# EAGLE design mp3triggerv3 (EAGLE 6.2)
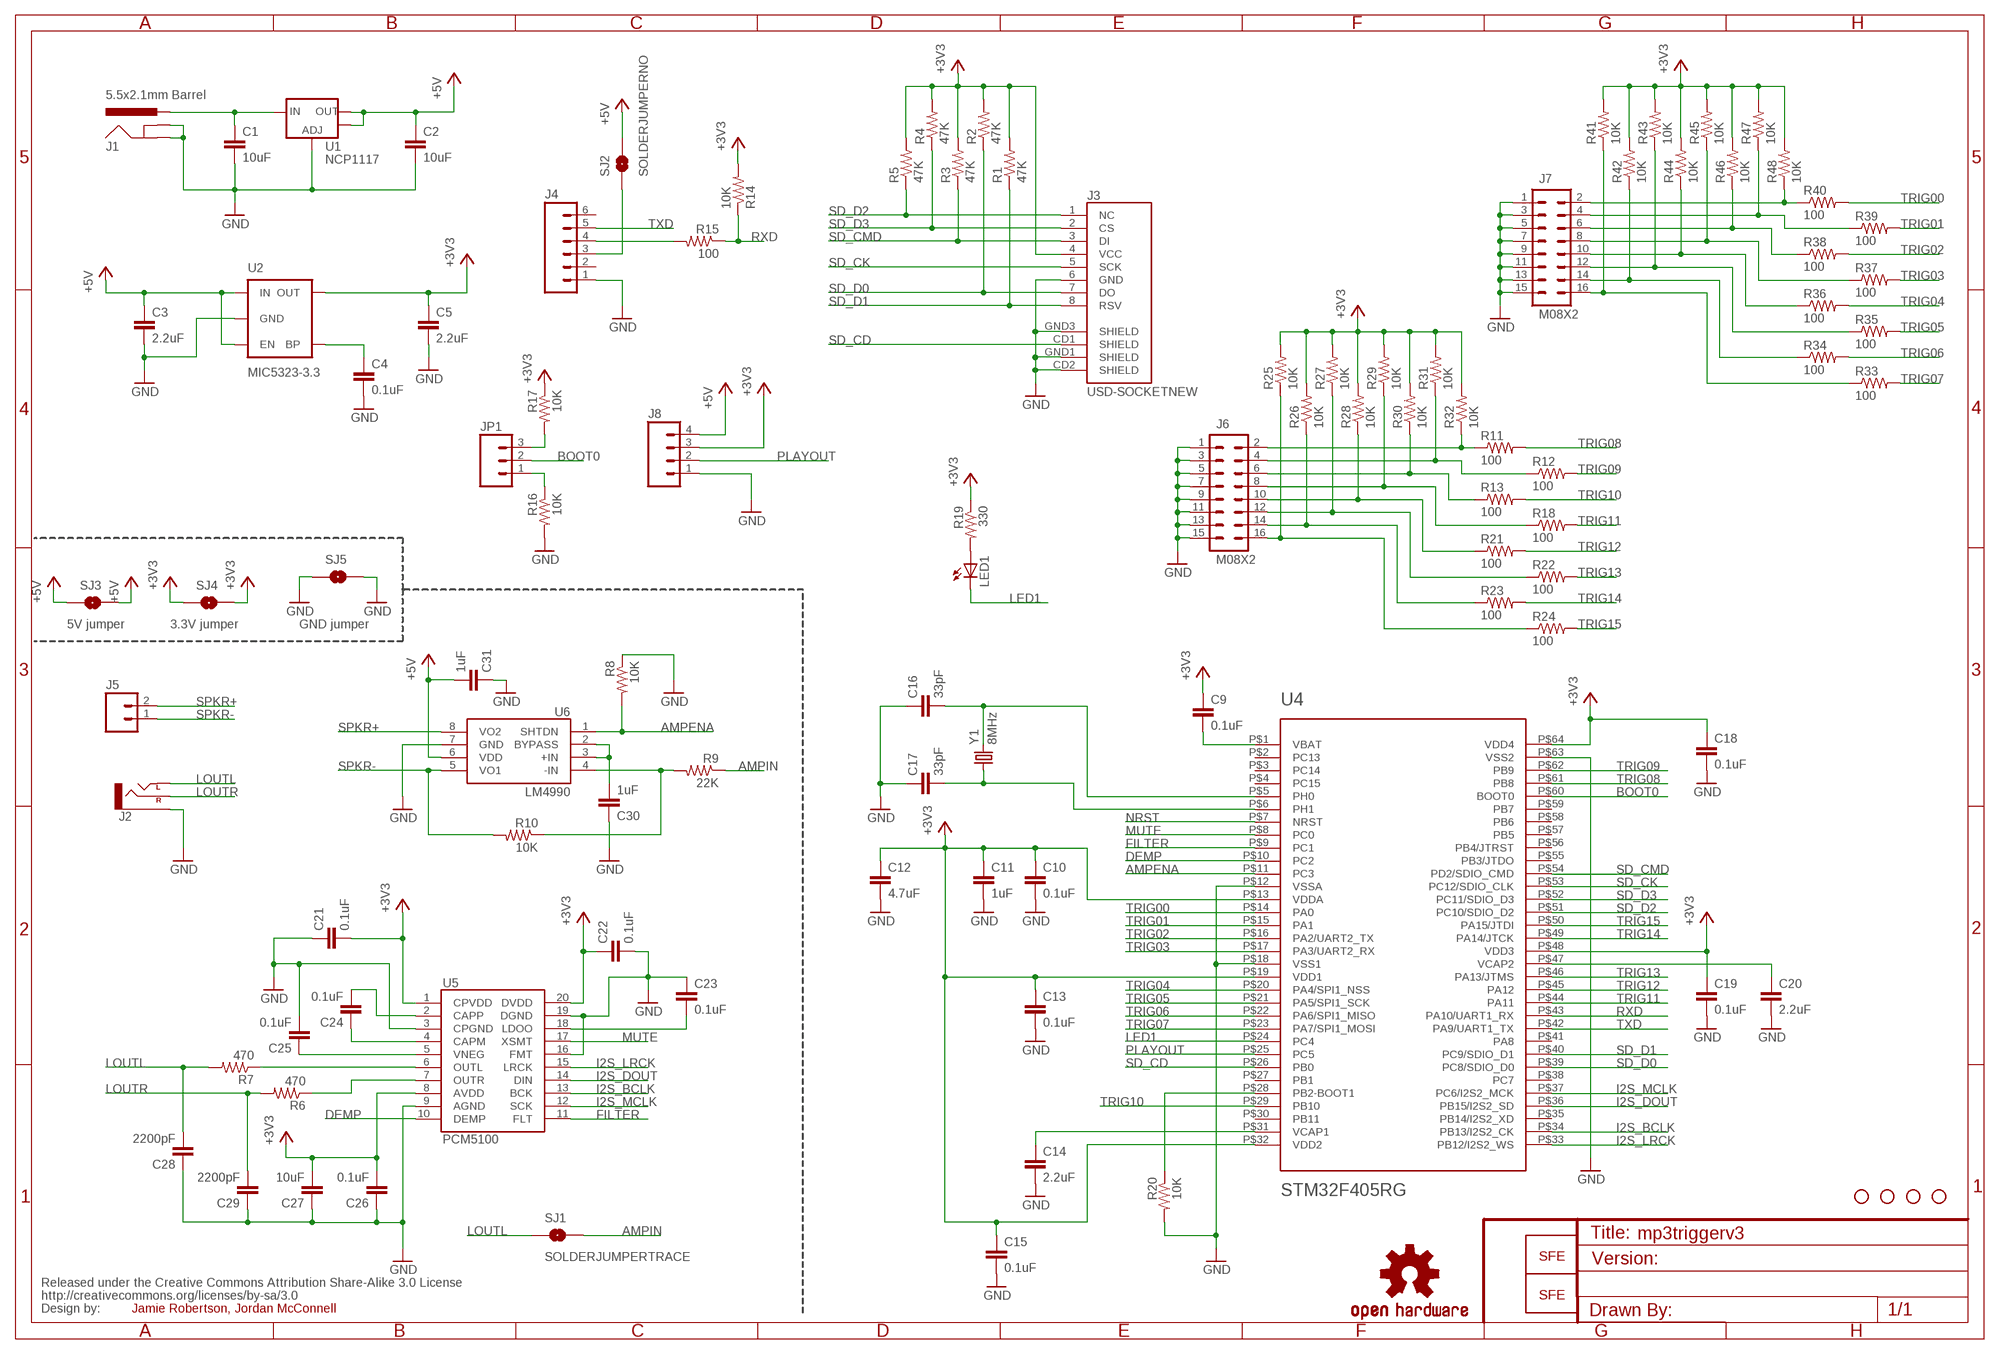
[diagram p0: schematic, sheet 1]

## Parts
C1  10uF  10UF50V20%(1210)  [1210]
C2  10uF  1UF-25V-10%(0805)  [0805]
C3  2.2uF  1UF-25V-10%(0805)  [0805]
C4  0.1uF  CAP0603-CAP  [0603-CAP]
C5  2.2uF  1UF-25V-10%(0805)  [0805]
C9  0.1uF  CAP0603-CAP  [0603-CAP]
C10  0.1uF  CAP0603-CAP  [0603-CAP]
C11  1uF  CAP0603-CAP  [0603-CAP]
C12  4.7uF  CAP0603-CAP  [0603-CAP]
C13  0.1uF  CAP0603-CAP  [0603-CAP]
C14  2.2uF  CAP0603-CAP  [0603-CAP]
C15  0.1uF  CAP0603-CAP  [0603-CAP]
C16  33pF  CAP0603-CAP  [0603-CAP]
C17  33pF  CAP0603-CAP  [0603-CAP]
C18  0.1uF  CAP0603-CAP  [0603-CAP]
C19  0.1uF  CAP0603-CAP  [0603-CAP]
C20  2.2uF  CAP0603-CAP  [0603-CAP]
C21  0.1uF  CAP0603-CAP  [0603-CAP]
C22  0.1uF  CAP0603-CAP  [0603-CAP]
C23  0.1uF  CAP0603-CAP  [0603-CAP]
C24  0.1uF  CAP0603-CAP  [0603-CAP]
C25  0.1uF  CAP0603-CAP  [0603-CAP]
C26  0.1uF  CAP0603-CAP  [0603-CAP]
C27  10uF  CAP0603-CAP  [0603-CAP]
C28  2200pF  CAP0603-CAP  [0603-CAP]
C29  2200pF  CAP0603-CAP  [0603-CAP]
C30  1uF  CAP0603-CAP  [0603-CAP]
C31  1uF  CAP0603-CAP  [0603-CAP]
CC_TEXT1  CREATIVE_COMMONS  [CREATIVE_COMMONS]
J1  5.5x2.1mm Barrel  POWER_JACKSMD  [POWER_JACK_SMD]
J2  AUDIO-JACKSMD2  [AUDIO-JACK-3.5MM-SMD]
J3  USD-SOCKETNEW  [MICRO-SD-SOCKET-PP]
J4  M06SIP  [1X06]
J5  M02PTH  [1X02]
J6  M08X2  [2X8]
J7  M08X2  [2X8]
J8  M04PTH  [1X04]
JP1  M03PTH  [1X03]
LED1  LED0603  [LED-0603]
LOGO1  OSHW-LOGOL  [OSHW-LOGO-L]
LOGO2  LOGO-SFENEW  [SFE-NEW-WEBLOGO]
LOGO3  LOGO-SFESK  [SFE-LOGO-FLAME]
R1  47K  RESISTOR0603-RES  [0603-RES]
R2  47K  RESISTOR0603-RES  [0603-RES]
R3  47K  RESISTOR0603-RES  [0603-RES]
R4  47K  RESISTOR0603-RES  [0603-RES]
R5  47K  RESISTOR0603-RES  [0603-RES]
R6  470  RESISTOR0603-RES  [0603-RES]
R7  470  RESISTOR0603-RES  [0603-RES]
R8  10K  RESISTOR0603-RES  [0603-RES]
R9  22K  RESISTOR0603-RES  [0603-RES]
R10  10K  RESISTOR0603-RES  [0603-RES]
R11  100  RESISTOR0603-RES  [0603-RES]
R12  100  RESISTOR0603-RES  [0603-RES]
R13  100  RESISTOR0603-RES  [0603-RES]
R14  10K  RESISTOR0603-RES  [0603-RES]
R15  100  RESISTOR0603-RES  [0603-RES]
R16  10K  RESISTOR0603-RES  [0603-RES]
R17  10K  RESISTOR0603-RES  [0603-RES]
R18  100  RESISTOR0603-RES  [0603-RES]
R19  330  RESISTOR0603-RES  [0603-RES]
R20  10K  RESISTOR0603-RES  [0603-RES]
R21  100  RESISTOR0603-RES  [0603-RES]
R22  100  RESISTOR0603-RES  [0603-RES]
R23  100  RESISTOR0603-RES  [0603-RES]
R24  100  RESISTOR0603-RES  [0603-RES]
R25  10K  RESISTOR0603-RES  [0603-RES]
R26  10K  RESISTOR0603-RES  [0603-RES]
R27  10K  RESISTOR0603-RES  [0603-RES]
R28  10K  RESISTOR0603-RES  [0603-RES]
R29  10K  RESISTOR0603-RES  [0603-RES]
R30  10K  RESISTOR0603-RES  [0603-RES]
R31  10K  RESISTOR0603-RES  [0603-RES]
R32  10K  RESISTOR0603-RES  [0603-RES]
R33  100  RESISTOR0603-RES  [0603-RES]
R34  100  RESISTOR0603-RES  [0603-RES]
R35  100  RESISTOR0603-RES  [0603-RES]
R36  100  RESISTOR0603-RES  [0603-RES]
R37  100  RESISTOR0603-RES  [0603-RES]
R38  100  RESISTOR0603-RES  [0603-RES]
R39  100  RESISTOR0603-RES  [0603-RES]
R40  100  RESISTOR0603-RES  [0603-RES]
R41  10K  RESISTOR0603-RES  [0603-RES]
R42  10K  RESISTOR0603-RES  [0603-RES]
R43  10K  RESISTOR0603-RES  [0603-RES]
R44  10K  RESISTOR0603-RES  [0603-RES]
R45  10K  RESISTOR0603-RES  [0603-RES]
R46  10K  RESISTOR0603-RES  [0603-RES]
R47  10K  RESISTOR0603-RES  [0603-RES]
R48  10K  RESISTOR0603-RES  [0603-RES]
SJ1  SOLDERJUMPERTRACE  [SJ_2S-TRACE]
SJ2  SOLDERJUMPERNO  [SJ_2S-NO]
SJ3  SOLDERJUMPERTRACE  [SJ_2S-TRACE]
SJ4  SOLDERJUMPERTRACE  [SJ_2S-TRACE]
SJ5  SOLDERJUMPERTRACE  [SJ_2S-TRACE]
STANDOFF1  STAND-OFF  [STAND-OFF]
STANDOFF2  STAND-OFF  [STAND-OFF]
STANDOFF3  STAND-OFF  [STAND-OFF]
STANDOFF4  STAND-OFF  [STAND-OFF]
U1  NCP1117  V_REG_LM1117SOT223  [SOT223]
U2  MIC5323-3.3  MIC52053.3V  [SOT23-5]
U4  STM32F405RG  [TQFP-10X10-64]
U5  PCM5100  [PW_R-PDSO-G20]
U6  LM4990  [S-PDSO-G08]
Y1  8MHz  CRYSTALSMD  [HC49UP]

## Nets
+5V: C2.1 C3.1 C31.2 J8.4 SJ2.2 SJ3.1 SJ3.2 U1.2(OUT) U1.4(OUT) U2.1(IN) U2.3(EN) U6.6(VDD)
AMPENA: R8.2 U4.P$11(PC3) U6.1(SHTDN)
AMPIN: R9.1 SJ1.2
BOOT0: JP1.2 U4.P$60(BOOT0)
DEMP: U4.P$10(PC2) U5.10(DEMP)
FILTER: U4.P$9(PC1) U5.11(FLT)
GND: C1.2 C2.2 C3.2 C4.2 C5.2 C10.2 C11.2 C12.2 C13.2 C14.2 C15.2 C16.1 C17.1 C18.2 C19.2 C20.2 C21.1 C22.2 C23.1 C25.2 C26.1 C27.1 C28.1 C29.1 C30.1 C31.1 J1.GND(GNDBREAK) J1.P$4(GND) J2.SLEEVE J3.6(GND) J3.CD2(SHIELD) J3.GND1(SHIELD) J3.GND3(SHIELD) J4.1 J6.1 J6.3 J6.5 J6.7 J6.9 J6.11 J6.13 J6.15 J7.1 J7.3 J7.5 J7.7 J7.9 J7.11 J7.13 J7.15 J8.1 R8.1 R16.2 R20.2 SJ5.1 SJ5.2 U1.1(ADJ) U2.2(GND) U4.P$12(VSSA) U4.P$18(VSS1) U4.P$63(VSS2) U5.3(CPGND) U5.9(AGND) U5.16(FMT) U5.19(DGND) U6.7(GND)
I2S_BCLK: U4.P$34(PB13/I2S2_CK) U5.13(BCK)
I2S_DOUT: U4.P$36(PB15/I2S2_SD) U5.14(DIN)
I2S_LRCK: U4.P$33(PB12/I2S2_WS) U5.15(LRCK)
I2S_MCLK: U4.P$37(PC6/I2S2_MCK) U5.12(SCK)
LED1: LED1.C U4.P$24(PC4)
LOUTL: C28.2 J2.TIP(LEFT) R7.2 SJ1.1
LOUTR: C29.2 J2.RING(RIGHT) R6.2
MUTE: U4.P$8(PC0) U5.17(XSMT)
N$1: J6.2 R11.1 R32.1
N$2: C4.1 U2.4(BP)
N$3: C9.2 U4.P$1(VBAT)
N$4: C14.1 U4.P$31(VCAP1)
N$5: C16.2 U4.P$5(PH0) Y1.2
N$6: C17.2 U4.P$6(PH1) Y1.1
N$7: JP1.1 R16.1
N$8: C20.1 U4.P$47(VCAP2)
N$9: J4.4 R15.2
N$10: JP1.3 R17.2
N$11: LED1.A R19.2
N$12: R20.1 U4.P$28(PB2-BOOT1)
N$14: C23.2 U5.18(LDOO)
N$15: R6.1 U5.7(OUTR)
N$16: C24.2 U5.2(CAPP)
N$17: C24.1 U5.4(CAPM)
N$18: C25.1 U5.5(VNEG)
N$19: R7.1 U5.6(OUTL)
N$20: C30.2 U6.2(BYPASS) U6.3(+IN)
N$23: J6.4 R12.1 R31.1
N$24: J6.6 R13.1 R30.1
N$25: J6.8 R18.1 R29.1
N$26: J6.10 R21.1 R28.1
N$27: J6.12 R22.1 R27.1
N$28: J6.14 R23.1 R26.1
N$29: R9.2 R10.1 U6.4(-IN)
N$30: J6.16 R24.1 R25.1
N$32: J4.3 SJ2.1
N$35: J7.2 R40.1 R48.1
N$36: J7.4 R39.1 R47.1
N$37: J7.6 R38.1 R46.1
N$38: J7.8 R37.1 R45.1
N$39: J7.10 R36.1 R44.1
N$40: J7.12 R35.1 R43.1
N$41: J7.14 R34.1 R42.1
N$42: J7.16 R33.1 R41.1
NRST: U4.P$7(NRST)
PLAYOUT: J8.2 U4.P$25(PC5)
RXD: R14.1 R15.1 U4.P$43(PA10/UART1_RX)
SD_CD: J3.CD1(SHIELD) U4.P$26(PB0)
SD_CK: J3.5(SCK) U4.P$53(PC12/SDIO_CLK)
SD_CMD: J3.3(DI) R3.1 U4.P$54(PD2/SDIO_CMD)
SD_D0: J3.7(DO) R2.1 U4.P$39(PC8/SDIO_D0)
SD_D1: J3.8(RSV) R1.1 U4.P$40(PC9/SDIO_D1)
SD_D2: J3.1(NC) R5.1 U4.P$51(PC10/SDIO_D2)
SD_D3: J3.2(CS) R4.1 U4.P$52(PC11/SDIO_D3)
SPKR+: J5.2 U6.8(VO2)
SPKR-: J5.1 R10.2 U6.5(VO1)
TRIG00: R40.2 U4.P$14(PA0)
TRIG01: R39.2 U4.P$15(PA1)
TRIG02: R38.2 U4.P$16(PA2/UART2_TX)
TRIG03: R37.2 U4.P$17(PA3/UART2_RX)
TRIG04: R36.2 U4.P$20(PA4/SPI1_NSS)
TRIG05: R35.2 U4.P$21(PA5/SPI1_SCK)
TRIG06: R34.2 U4.P$22(PA6/SPI1_MISO)
TRIG07: R33.2 U4.P$23(PA7/SPI1_MOSI)
TRIG08: R11.2 U4.P$61(PB8)
TRIG09: R12.2 U4.P$62(PB9)
TRIG10: R13.2 U4.P$29(PB10)
TRIG11: R18.2 U4.P$44(PA11)
TRIG12: R21.2 U4.P$45(PA12)
TRIG13: R22.2 U4.P$46(PA13/JTMS)
TRIG14: R23.2 U4.P$49(PA14/JTCK)
TRIG15: R24.2 U4.P$50(PA15/JTDI)
TXD: J4.5 U4.P$42(PA9/UART1_TX)
VCC: C5.1 C9.1 C10.1 C11.1 C12.1 C13.1 C15.1 C18.1 C19.1 C21.2 C22.1 C26.2 C27.2 J3.4(VCC) J8.3 R1.2 R2.2 R3.2 R4.2 R5.2 R14.2 R17.1 R19.1 R25.2 R26.2 R27.2 R28.2 R29.2 R30.2 R31.2 R32.2 R41.2 R42.2 R43.2 R44.2 R45.2 R46.2 R47.2 R48.2 SJ4.1 SJ4.2 U2.5(OUT) U4.P$13(VDDA) U4.P$19(VDD1) U4.P$32(VDD2) U4.P$48(VDD3) U4.P$64(VDD4) U5.1(CPVDD) U5.8(AVDD) U5.20(DVDD) ; supply symbol labelled +3V3
VIN_9V: C1.1 J1.VIN0(PWR) U1.3(IN)
Unconnected: J4.2 J4.6 U4.P$2(PC13) U4.P$3(PC14) U4.P$4(PC15) U4.P$27(PB1) U4.P$30(PB11) U4.P$35(PB14/I2S2_XD) U4.P$38(PC7) U4.P$41(PA8) U4.P$55(PB3/JTDO) U4.P$56(PB4/JTRST) U4.P$57(PB5) U4.P$58(PB6) U4.P$59(PB7)

## Notes on the sheet
- 5V jumper | 3.3V jumper | GND jumper
- Jamie Robertson, Jordan McConnell

## Library data of the parts
C1 = SparkFun-Capacitors:10UF50V20%(1210): CAP-09824; PROD_ID: CAP-09824
C2 C3 C5 = SparkFun-Capacitors:1UF-25V-10%(0805): CAP-08064; PROD_ID: CAP-08064; VALUE: 1uF
C4 C9-C31 = SparkFun-Capacitors:CAP: Capacitor Standard 0603 ceramic capacitor, and 0.1" leaded capacitor.
CC_TEXT1 = SparkFun-Aesthetics:CREATIVE_COMMONS: Creative Commons License summary
J1 = SparkFun-Connectors:POWER_JACK: Power Jack This is the standard 5.5mm barrel jack for power. The PTH is the most common, proven, reliable, footprint. The Slot footprint only works if the mill layer is transmitted to the PCB fab house so be warned. Spark Fun Electronics SKU : PRT-00119 SMT: CONN-08106 Mating wall wart : TOL-00298 (and others); PROD_ID: CONN-08106
J2 = SparkFun-Connectors:AUDIO-JACK: 3.5mm Audio Jack Simple 3.5mm common PCB mount audio jack. SKU: PRT-08032
J3 = robertsonics:USD-SOCKET: microSD Socket Push-push type uSD socket. Schematic element and footprint production proven. Spark Fun Electronics SKU : PRT-00127. tDoc lines correctly indicate media card edge positions when inserting (unlocked, locked, depressed).
J4 = SparkFun-Connectors:M06: Header 6 Standard 6-pin 0.1" header. Use with straight break away headers (SKU : PRT-00116), right angle break away headers (PRT-00553), swiss pins (PRT-00743), machine pins (PRT-00117), and female headers (PRT-00115). Molex polarized connector foot print use with SKU : PRT-08094 with associated crimp pins and housings. NOTES ON THE VARIANTS LOCK and LOCK_LONGPADS... This footprint was designed to help hold the alignment of a through-hole component (i.e. 6-pin header) while soldering it into place. You may notice that each hole has been shifted either up or down by 0.005 of an inch from it's more standard position (which is a perfectly straight line). This slight alteration caused the pins (the squares in the middle) to touch the edges of the holes. Because they are alternating, it causes a "brace" to hold the component in place. 0.005 has proven to be the perfect amount of "off-center" position when using our standard breakaway headers. Although looks a little odd when you look at the bare footprint, once you have a header in there, the alteration is very hard to notice. Also, if you push a header all the way into place, it is covered up entirely on the bottom side. This idea of altering the position of holes to aid alignment will be further integrated into the Sparkfun Library for other footprints. It can help hold any component with 3 or more connection pins.
J5 = SparkFun-Connectors:M02: Header 2 Standard 2-pin 0.1" header. Use with straight break away headers (SKU : PRT-00116), right angle break away headers (PRT-00553), swiss pins (PRT-00743), machine pins (PRT-00117), and female headers (PRT-00115). Molex polarized connector foot print use with SKU : PRT-08233 with associated crimp pins and housings.
J6 J7 = SparkFun-Connectors:M08X2: .1" headers, two rows of 8 each
J8 = SparkFun-Connectors:M04: Header 4 Standard 4-pin 0.1" header. Use with straight break away headers (SKU : PRT-00116), right angle break away headers (PRT-00553), swiss pins (PRT-00743), machine pins (PRT-00117), and female headers (PRT-00115). Molex polarized connector foot print use with SKU : PRT-08231 with associated crimp pins and housings. 1MM SMD Version SKU: PRT-10208
JP1 = SparkFun-Connectors:M03: Header 3 Standard 3-pin 0.1" header. Use with straight break away headers (SKU : PRT-00116), right angle break away headers (PRT-00553), swiss pins (PRT-00743), machine pins (PRT-00117), and female headers (PRT-00115). Molex polarized connector foot print use with SKU : PRT-08232 with associated crimp pins and housings.
LED1 = SparkFun-LED:LED: LEDs Standard schematic elements and footprints for 5mm, 3mm, 1206, and 0603 sized LEDs. 5mm - Spark Fun Electronics SKU : COM-00529 (and others)
LOGO1 = SparkFun-Aesthetics:OSHW-LOGO: Open Source Hardware Logo This logo indicates the piece of hardware it is found on incorporates a OSHW license and/or adheres to the definition of open source hardware found here: http://freedomdefined.org/OSHW
LOGO2 LOGO3 = SparkFun-Aesthetics:LOGO-SFE: Spark Fun Electronics PCB Logo This is the standard Spark Fun Electronics PCB logo.
R1-R48 = SparkFun-Passives:RESISTOR: Resistor Basic schematic elements and footprints for 0603, 1206, and PTH resistors.
SJ1-SJ5 = SparkFun-Passives:SOLDERJUMPER: Solder Jumper Standard SMD solder jumper. Used to automate production. Two varients : Normally Open and Normally Closed are the same, but have different paste layers. NC will have a large amount of paste and should jumper during reflow.
STANDOFF1-STANDOFF4 = SparkFun-Electromechanical:STAND-OFF: #4 Stand Off This is the mechanical footprint for a #4 phillips button head screw. Use the keepout ring to avoid running the screw head into surrounding components. SKU : PRT-00447
U1 = SparkFun-PowerIC:V_REG_LM1117: Voltage Regulator LM1117 Standard adjustable voltage regulator but in SMD form. Spark Fun Electronics SKU : COM-00595
U2 = SparkFun-PowerIC:MIC5205: MIC5205 150mA vreg 3.3V - VREG-00822 5V - VREG-00823; PROD_ID: VREG-00822
U4 = robertsonics:STM32F405RG: STM32F405RG LQFP64
U5 = robertsonics:PCM5100: PCM5100 Stereo DAC
U6 = robertsonics:LM4990: LM4990 2 Watt Audio Amp
Y1 = SparkFun-FreqCtrl:CRYSTAL: Various standard crystals. Proven footprints. Spark Fun Electronics SKU : COM-00534

## Board
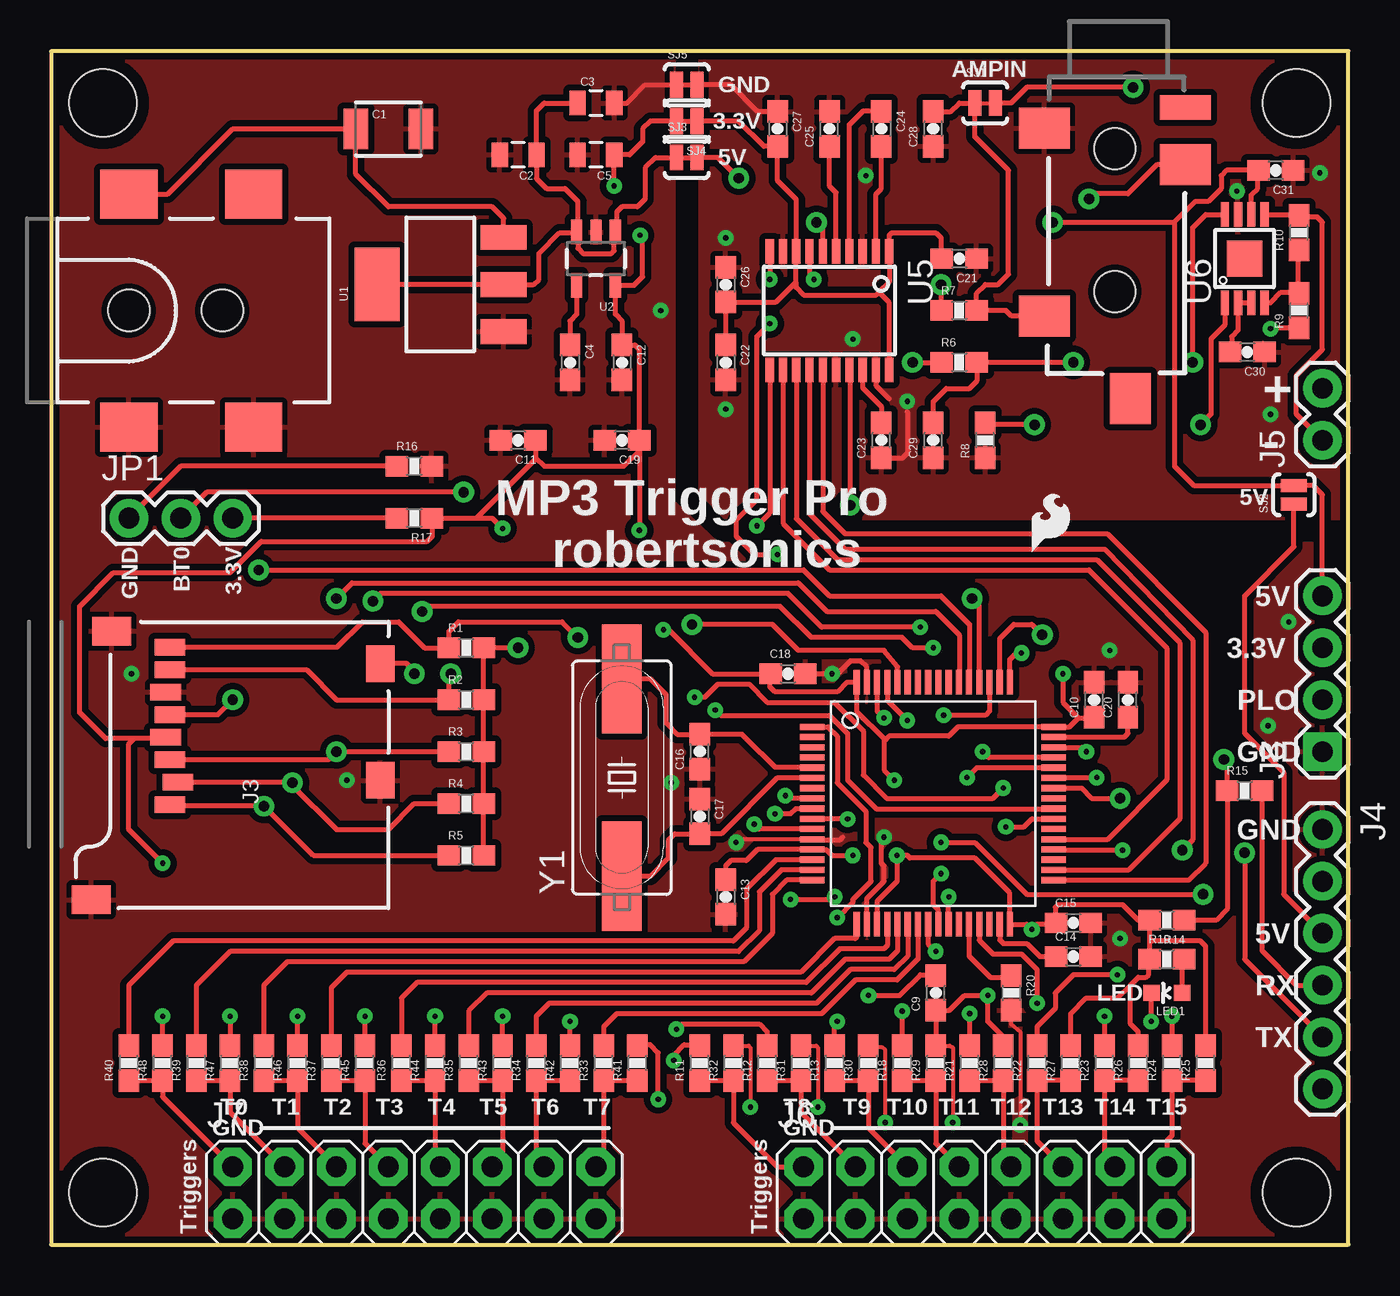
[diagram p1: board, top side]
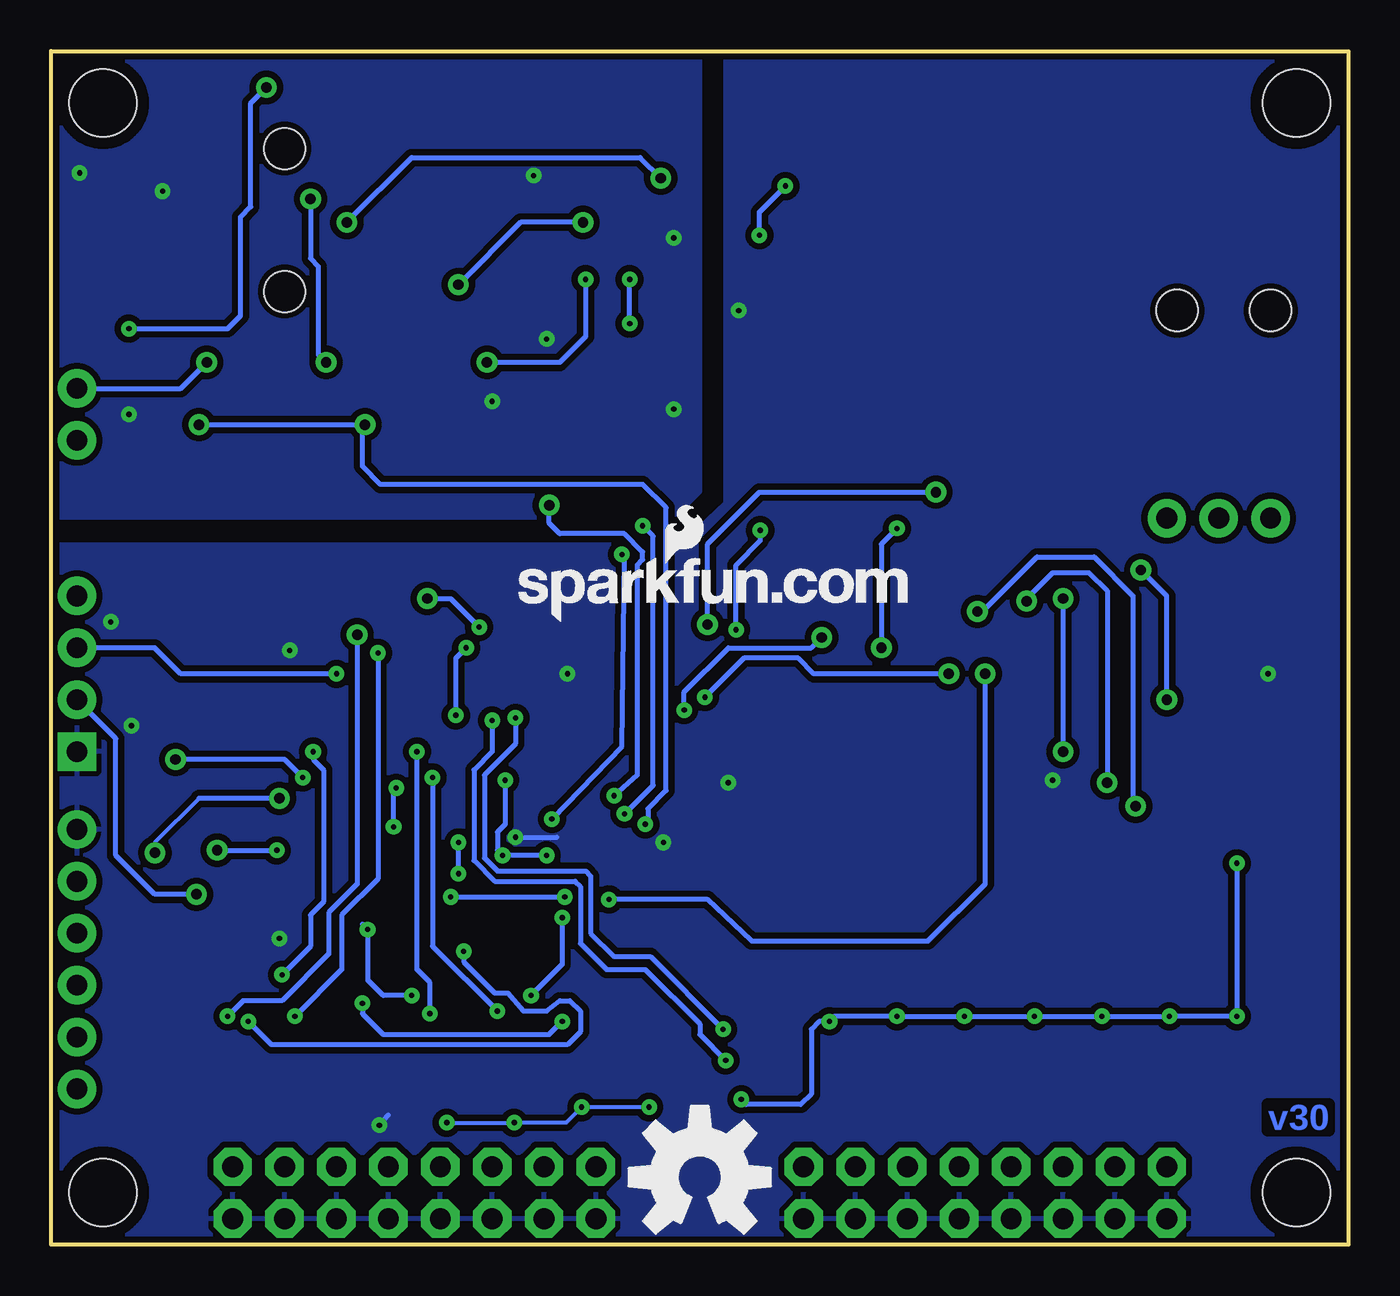
[diagram p2: board, bottom side, seen from below]

Size 63.5 x 58.42 mm. Coordinates in mm from the lower left corner, seen from the top.
Outline: 0,0 63.5,0 63.5,58.42 0,58.41 0,0
Copper layers (1*16): Top 0.035mm / dielectric 1.5mm / Bottom 0.035mm
Design rules "default": minimum track width 8mil, minimum drill 10mil, track to track 6mil, track to pad 6mil, pad to pad 6mil, via to via 6mil, smd to smd 6mil, copper to edge 8mil, drill to drill 8mil, minimum pad ring 12mil, minimum via ring 10mil, stop-mask expansion 4mil, vias tented up to drill 20mil, thermal gap 10mil

### Footprints (pad centres in the part's own frame; a part is rotated, then mirrored left to right if it is on the bottom)
1210 = smd 1.2 x 2: 1 -1.6,0; 2 1.6,0
0805 = smd 0.8 x 1.2: 1 -0.9,0; 2 0.9,0
0603-CAP = smd 1.1 x 1: 1 -0.85,0; 2 0.85,0
POWER_JACK_SMD = smd 2.8 x 2.4: GND 0,-5.7; P$4 6.1,-5.7; VIN0 0,5.7; VIN1 6.1,5.7 | hole 2.032: 0,0; 4.572,0
AUDIO-JACK-3.5MM-SMD = smd 2 x 2.5: RING 4.3,3.45; SLEEVE 2.5,-3.45; TIP 11.7,-3.45 | smd 1.2 x 2.5: RSH 1.5,3.45 | smd 2.5 x 2: TSH 15.75,0.75 | hole 2: 3.5,0; 10.5,0
MICRO-SD-SOCKET-PP = smd 0.8 x 1.5: 1 -8.94,10.7; 2 -7.84,10.3; 3 -6.74,10.7; 4 -5.64,10.9; 5 -4.54,10.7; 6 -3.44,10.9; 7 -2.34,10.7; 8 -1.24,10.7 | smd 1.8 x 1.4: CD1 -2.05,0.4; CD2 -7.75,0.4 | smd 1.4 x 1.9: GND1 -13.6,14.55; GND3 -0.45,13.55
1X06 = drill 1.016 pad 1.88: 1 0,0; 2 2.54,0; 3 5.08,0; 4 7.62,0; 5 10.16,0; 6 12.7,0
1X02 = drill 1.016 pad 1.88: 1 0,0; 2 2.54,0
2X8 = drill 1.016 pad 1.88 octagon: 1 0,0; 2 0,2.54; 3 2.54,0; 4 2.54,2.54; 5 5.08,0; 6 5.08,2.54; 7 7.62,0; 8 7.62,2.54; 9 10.16,0; 10 10.16,2.54; 11 12.7,0; 12 12.7,2.54; 13 15.24,0; 14 15.24,2.54; 15 17.78,0; 16 17.78,2.54
1X04 = drill 1.016 pad 1.88 square: 1 0,0 | drill 1.016 pad 1.88: 2 2.54,0; 3 5.08,0; 4 7.62,0
1X03 = drill 1.016 pad 1.88: 1 0,0; 2 2.54,0; 3 5.08,0
LED-0603 = smd 0.8 x 0.8: A 0,-0.75; C 0,0.75
0603-RES = smd 1.1 x 1: 1 -0.85,0; 2 0.85,0
SJ_2S-TRACE = smd 0.635 x 1.27: 1 -0.508,0; 2 0.508,0
SJ_2S-NO = smd 0.635 x 1.27: 1 -0.45,0; 2 0.45,0
STAND-OFF = hole 3.302: 0,0
SOT223 = smd 1.219 x 2.235: 1 -2.311,-3.099; 2 0,-3.099; 3 2.311,-3.099 | smd 3.6 x 2.2: 4 0,3.099
SOT23-5 = smd 0.55 x 1.2: 1 -0.95,-1.3; 2 0,-1.3; 3 0.95,-1.3; 4 0.95,1.3; 5 -0.95,1.3
TQFP-10X10-64 = smd 1.2 x 0.3: P$1 -5.936,3.75; P$2 -5.936,3.25; P$3 -5.936,2.75; P$4 -5.936,2.25; P$5 -5.936,1.75; P$6 -5.936,1.25; P$7 -5.936,0.75; P$8 -5.936,0.25; P$9 -5.936,-0.25; P$10 -5.936,-0.75; P$11 -5.936,-1.25; P$12 -5.936,-1.75; P$13 -5.936,-2.25; P$14 -5.936,-2.75; P$15 -5.936,-3.25; P$16 -5.936,-3.75; P$33 5.886,-3.75; P$34 5.886,-3.25; P$35 5.886,-2.75; P$36 5.886,-2.25; P$37 5.886,-1.75; P$38 5.886,-1.25; P$39 5.886,-0.75; P$40 5.886,-0.25; P$41 5.886,0.25; P$42 5.886,0.75; P$43 5.886,1.25; P$44 5.886,1.75; P$45 5.886,2.25; P$46 5.886,2.75; P$47 5.886,3.25; P$48 5.886,3.75 | smd 0.3 x 1.2: P$17 -3.75,-5.911; P$18 -3.25,-5.911; P$19 -2.75,-5.911; P$20 -2.25,-5.911; P$21 -1.75,-5.911; P$22 -1.25,-5.911; P$23 -0.75,-5.911; P$24 -0.25,-5.911; P$25 0.25,-5.911; P$26 0.75,-5.911; P$27 1.25,-5.911; P$28 1.75,-5.911; P$29 2.25,-5.911; P$30 2.75,-5.911; P$31 3.25,-5.911; P$32 3.75,-5.911; P$49 3.75,5.936; P$50 3.25,5.936; P$51 2.75,5.936; P$52 2.25,5.936; P$53 1.75,5.936; P$54 1.25,5.936; P$55 0.75,5.936; P$56 0.25,5.936; P$57 -0.25,5.936; P$58 -0.75,5.936; P$59 -1.25,5.936; P$60 -1.75,5.936; P$61 -2.25,5.936; P$62 -2.75,5.936; P$63 -3.25,5.936; P$64 -3.75,5.936
PW_R-PDSO-G20 = smd 0.4 x 1.2: 1 -2.925,-2.9; 2 -2.275,-2.9; 3 -1.625,-2.9; 4 -0.975,-2.9; 5 -0.325,-2.9; 6 0.325,-2.9; 7 0.975,-2.9; 8 1.625,-2.9; 9 2.275,-2.9; 10 2.925,-2.9; 11 2.925,2.9; 12 2.275,2.9; 13 1.625,2.9; 14 0.975,2.9; 15 0.325,2.9; 16 -0.325,2.9; 17 -0.975,2.9; 18 -1.625,2.9; 19 -2.275,2.9; 20 -2.925,2.9
S-PDSO-G08 = smd 0.4 x 1.2: 1 -0.975,-2.157; 2 -0.325,-2.157; 3 0.325,-2.157; 4 0.975,-2.157; 5 0.975,2.157; 6 0.325,2.157; 7 -0.325,2.157; 8 -0.975,2.157 | smd 1.73 x 1.78: TH 0,0
HC49UP = smd 5.334 x 1.93: 1 -4.826,0; 2 4.826,0

### Placement (x,y rotation side)
C1  16.51,54.61 0 top
C2  22.86,53.34 180 top
C3  26.67,55.88 0 top
C4  25.4,43.18 270 top
C5  26.67,53.34 180 top
C9  43.31,12.32 90 top
C10  51.05,26.67 90 top
C11  22.86,39.37 180 top
C12  27.94,43.18 270 top
C13  33.02,17.02 270 top
C14  50.04,14.1 0 top
C15  50.04,15.75 0 top
C16  31.75,24.13 90 top
C17  31.75,20.95 270 top
C18  36.07,27.94 0 top
C19  27.94,39.37 180 top
C20  52.7,26.67 90 top
C21  44.45,48.26 180 top
C22  33.02,43.18 270 top
C23  40.64,39.37 90 top
C24  40.64,54.61 270 top
C25  38.1,54.61 90 top
C26  33.02,46.99 270 top
C27  35.56,54.61 270 top
C28  43.18,54.61 90 top
C29  43.18,39.37 90 top
C30  58.55,43.69 180 top
C31  59.94,52.58 180 top
CC_TEXT1  17.78,-10.16 0 top  (outside the outline)
J1  3.81,45.72 0 top
J2  52.07,57.15 270 top
J3  16.51,30.48 90 top
J4  62.23,20.32 270 top
J5  62.23,39.37 90 top
J6  36.83,1.27 0 top
J7  8.89,1.27 0 top
J8  62.23,24.13 90 top
JP1  3.81,35.56 0 top
LED1  54.61,12.32 90 top
LOGO1  31.75,3.3 0 bottom
LOGO2  40.64,30.48 0 bottom
LOGO3  48.01,33.91 0 top
R1  20.32,29.21 0 top
R2  20.32,26.67 0 top
R3  20.32,24.13 0 top
R4  20.32,21.59 0 top
R5  20.32,19.05 0 top
R6  44.45,43.18 0 top
R7  44.45,45.72 0 top
R8  45.72,39.37 90 top
R9  61.09,45.72 90 top
R10  61.09,49.53 90 top
R11  31.75,8.89 90 top
R12  35.05,8.89 90 top
R13  38.35,8.89 90 top
R14  54.61,15.88 180 top
R15  58.42,22.23 0 top
R16  17.78,38.1 0 top
R17  17.78,35.56 180 top
R18  41.66,8.89 90 top
R19  54.61,13.97 0 top
R20  46.99,12.32 270 top
R21  44.96,8.89 90 top
R22  48.26,8.89 90 top
R23  51.56,8.89 90 top
R24  54.86,8.89 90 top
R25  56.52,8.89 90 top
R26  53.21,8.89 90 top
R27  49.91,8.89 90 top
R28  46.61,8.89 90 top
R29  43.31,8.89 90 top
R30  40.01,8.89 90 top
R31  36.7,8.89 90 top
R32  33.4,8.89 90 top
R33  27.05,8.89 90 top
R34  23.75,8.89 90 top
R35  20.45,8.89 90 top
R36  17.14,8.89 90 top
R37  13.72,8.89 90 top
R38  10.41,8.89 90 top
R39  7.11,8.89 90 top
R40  3.81,8.89 90 top
R41  28.7,8.89 90 top
R42  25.4,8.89 90 top
R43  22.1,8.89 90 top
R44  18.8,8.89 90 top
R45  15.37,8.89 90 top
R46  12.06,8.89 90 top
R47  8.76,8.89 90 top
R48  5.46,8.89 90 top
SJ1  45.72,55.88 0 top
SJ2  60.83,36.7 90 top
SJ3  31.11,53.21 0 top
SJ4  31.11,54.99 180 top
SJ5  31.11,56.77 0 top
STANDOFF1  2.54,2.54 0 top
STANDOFF2  60.96,2.54 0 top
STANDOFF3  2.54,55.88 0 top
STANDOFF4  60.96,55.88 0 top
U1  19.05,46.99 90 top
U2  26.67,48.26 180 top
U4  43.18,21.59 0 top
U5  38.1,45.72 180 top
U6  58.42,48.26 0 top
Y1  27.94,22.86 90 top

### Tracks (layer width: path | path; a pad name or v marks a point on that pad's centre or on a via)
+5V  (via drill 0.51)
  Top 0.254: U6.6 58.74,51.38 59.05,51.69 59.05,52.54 C31.2 57.53,52.58 57.28,52.32 57.28,51.69 56.64,51.05 56.01,51.05 54.99,50.04 | 54.99,50.04 54.99,38.1 55.94,37.15 SJ2.2 | v49.02,50.04 54.99,50.04 | 25.78,49.62 U2.3 25.69,49.53 24.89,49.53 23.88,48.51 23.88,47.24 23.62,46.99 U1.2 U1.4 | 25.78,49.62 25.78,51.05 25.15,51.69 24.26,51.69 23.76,52.19 C2.1 23.76,55.51 24.13,55.88 C3.1 | 25.78,49.62 25.78,48.77 26.04,48.51 27.43,48.51 27.56,48.64 27.56,49.5 U2.1 27.69,49.63 27.69,50.55 27.94,50.8 28.7,50.8 29.08,51.18 29.08,52.7 29.59,53.21 SJ3.1 SJ3.2 32.64,53.21 v33.66,52.2 | 60.76,37.08 SJ2.2 | J8.4 62.23,36.7 61.78,37.15 SJ2.2 | 60.89,37.21 SJ2.2
  Bottom 0.254: v49.02,50.04 45.85,53.21 34.67,53.21 v33.66,52.2
AMPENA  (via drill 0.25, 0.51)
  Top 0.254: U6.1 57.45,45 56.77,44.32 56.77,40.64 v56.26,40.13 | U4.P$11 34.65,20.34 v34.42,20.57 | v48.13,40.13 45.81,40.13 R8.2
  Bottom 0.254: v34.42,20.57 34.29,20.7 34.29,21.34 33.4,22.23 33.4,36.07 34.54,37.21 47.37,37.21 48.26,38.1 48.26,40.01 v48.13,40.13 v56.26,40.13
AMPIN  (via drill 0.25, 0.51)
  Top 0.254: R9.1 59.73,44.87 v59.69,44.83 | SJ1.2 46.99,55.88 47.75,56.64 v52.96,56.64
  Bottom 0.254: v59.69,44.83 54.86,44.83 54.23,45.47 54.23,50.29 53.72,50.8 53.72,55.88 v52.96,56.64
BOOT0  (via drill 0.51)
  Top 0.254: v31.37,30.35 35.31,30.35 36.58,29.08 40.77,29.08 41.43,28.29 U4.P$60 | v20.19,36.83 7.62,36.83 JP1.2
  Bottom 0.254: v31.37,30.35 31.37,34.29 28.83,36.83 v20.19,36.83
DEMP  (via drill 0.25)
  Top 0.254: U5.10 v35.17,47.25 v35.18,47.24 | v38.99,20.83 37.26,20.83 U4.P$10 | v35.18,45.09 34.54,44.45 34.54,36.45 33.53,35.43 33.53,34.67 34.42,33.78 v35.56,33.78
  Bottom 0.254: v38.99,20.83 35.56,24.38 35.43,33.66 v35.56,33.78 | v35.18,45.09 v35.18,47.24
FILTER  (via drill 0.25)
  Top 0.254: U5.11 35.17,35.81 v34.54,35.18 | U4.P$9 36.45,21.34 36.2,21.08 v35.43,21.08
  Bottom 0.254: v35.43,21.08 34.04,22.48 34.04,34.67 v34.54,35.18
GND  (via drill 0.25)
  Top 0.203: R20.2 46.99,10.79 47.43,10.41 v47.43,5.84 | U4.P$12 33.68,19.84 v33.53,19.68
  Top 0.254: C27.1 34.58,55.46 33.27,56.77 SJ5.2 SJ5.1 29.08,56.77 28.19,55.88 C3.2 | U4.P$63 39.93,28.27 39.62,28.57 39.12,28.57 38.48,27.94 C18.2 | U4.P$18 39.93,16.94 40.77,17.78 40.77,18.54 40.64,18.67 40.64,19.81 v40.77,19.94 | U4.P$12 37.27,19.81 38.61,19.81 38.73,19.94 | U5.19 40.38,42.05 41.02,41.4 | 41.91,40.77 41.91,38.73 41.66,38.48 40.68,38.48 C23.1
  Bottom 0.254: v40.77,19.94 38.73,19.94 | v47.43,5.84 46.99,6.35
  other vias: 30.35,22.61 58.04,51.56 62.1,52.45 59.69,40.64 39.88,52.32 33.02,49.28 33.02,40.89 41.91,41.27 51.82,29.08 59.56,25.4 60.58,30.48 52.32,14.99 38.23,27.94 3.94,27.94 14.48,22.73 29.84,45.72 39.24,44.32
  pour Bottom (isolate 0.305): 0,58.42 0,0 63.5,0 63.5,34.29 32.64,34.29 30.48,36.32 30.48,58.42
  pour Top (isolate 0.305): 0,58.42 0,0 63.5,0 63.5,34.29 32.64,34.29 30.48,36.32 30.48,58.42
  pour Top (isolate 0.305): 31.75,58.42 31.75,36.83 33.02,35.56 63.5,35.56 63.5,58.42
  pour Bottom (isolate 0.305): 31.75,58.42 31.75,36.83 33.02,35.56 63.5,35.56 63.5,58.42
I2S_BCLK
  Top 0.254: U5.13 36.48,35.53 38.48,33.53 51.18,33.53 55.24,29.46 55.24,20.83 52.76,18.34 U4.P$34
I2S_DOUT  (via drill 0.25, 0.51)
  Top 0.254: U5.14 37.12,35.77 38.86,34.04 51.56,34.04 55.88,29.59 55.88,19.81 v55.37,19.3 | v52.45,19.3 49.1,19.3 U4.P$36
  Bottom 0.254: v55.37,19.3 v52.45,19.3
I2S_LRCK
  Top 0.254: U5.15 37.77,35.88 38.86,34.8 51.69,34.8 56.52,29.97 56.52,18.67 55.69,17.84 U4.P$33
I2S_MCLK
  Top 0.254: U5.12 35.83,35.3 38.1,33.02 50.8,33.02 54.61,29.21 54.61,22.73 51.69,19.81 49.09,19.81 U4.P$37
LED1  (via drill 0.25)
  Top 0.254: U4.P$24 42.93,14.73 v43.31,14.35 | v53.85,10.92 53.85,12.31 LED1.C
  Bottom 0.254: v43.31,14.35 43.31,13.84 41.78,12.32 41.15,12.32 40.39,11.43 39.24,11.43 38.61,11.94 38.1,11.94 37.59,11.43 37.59,10.41 38.23,9.78 52.7,9.78 v53.85,10.92
LOUTL
  Top 0.254: C28.2 44.03,55.46 44.45,55.88 SJ1.1 45.21,54.23 46.86,52.58 46.86,47.5 46.35,46.99 45.72,46.99 45.3,46.57 R7.2 46.74,45.72 47.01,45.45 J2.TIP
LOUTR  (via drill 0.51)
  Top 0.254: C29.2 43.18,41.27 43.81,41.91 44.96,41.91 45.34,42.29 45.34,43.14 R6.2 v50.04,43.18 | J2.RING 54.12,52.85 52.7,51.44 51.05,51.44 v50.8,51.18
  Bottom 0.254: v50.8,51.18 50.8,48.26 50.42,47.88 50.42,43.56 v50.04,43.18
MUTE  (via drill 0.25, 0.51)
  Top 0.254: v39.12,36.2 39.12,42.78 U5.17 | U4.P$8 36.07,21.84 v35.94,21.97
  Bottom 0.254: v35.94,21.97 34.8,22.99 34.8,33.27 34.54,33.53 34.54,33.91 35.43,34.8 38.61,34.8 39.12,35.31 v39.12,36.2
N$1
  Top 0.254: R11.1 R32.1 33.4,5.97 35.56,3.81 J6.2
N$2
  Top 0.254: U2.4 25.72,45.53 25.4,45.21 C4.1
N$3  (via drill 0.25)
  Top 0.254: U4.P$1 38.03,25.34 38.48,24.89 38.48,22.61 39.88,21.21 39.88,19.68 40.13,19.43 40.13,17.78 39.24,16.89 39.24,16.76 v38.48,16 | v40.01,12.19 41.53,12.19 42.55,13.21 43.27,13.21 C9.2
  Bottom 0.254: v38.48,16 38.48,13.72 v40.01,12.19
N$4
  Top 0.254: U4.P$31 46.43,14.91 46.61,14.73 47.75,14.73 48.39,14.1 C14.1
N$5
  Top 0.254: Y1.2 29.34,27.69 30.1,26.92 30.1,25.53 30.65,24.98 C16.2 33.82,24.98 34.02,24.78 35.43,23.37 37.22,23.37 U4.P$5
N$6
  Top 0.254: Y1.1 29.34,18.03 30.23,18.92 30.23,19.81 30.52,20.11 C17.2 32.8,20.11 35.54,22.84 U4.P$6
N$7
  Top 0.254: R16.1 6.35,38.1 JP1.1
N$8
  Top 0.254: U4.P$47 52.53,24.84 52.7,25.02 C20.1
N$9
  Top 0.254: R15.2 59.27,14.39 60.96,12.7 J4.4
N$10
  Top 0.254: R17.2 JP1.3
N$11
  Top 0.254: LED1.A 55.36,13.87 R19.2
N$12
  Top 0.254: U4.P$28 44.93,14.12 45.97,13.08 46.9,13.08 R20.1
N$14
  Top 0.254: U5.18 39.73,41.94 40.64,41.02 C23.2
N$15  (via drill 0.25, 0.51)
  Top 0.254: U5.7 37.12,47.46 v37.34,47.24 | v42.16,43.18 R6.1
  Bottom 0.254: v37.34,47.24 37.34,44.45 38.61,43.18 v42.16,43.18
N$16
  Top 0.254: U5.2 40.38,51.42 40.64,51.69 C24.2
N$17
  Top 0.254: U5.4 39.08,54.82 39.75,55.5 40.6,55.5 C24.1
N$18
  Top 0.254: U5.5 38.42,51.49 38.1,51.82 C25.1
N$19  (via drill 0.51)
  Top 0.254: U5.6 37.77,49.73 v37.47,50.04 | v43.56,46.99 43.56,45.76 R7.1
  Bottom 0.254: v37.47,50.04 40.51,50.04 v43.56,46.99
N$20
  Top 0.254: C30.2 57.78,43.78 57.78,44.45 58.09,44.76 U6.2 U6.3
N$23
  Top 0.254: R12.1 R31.1 36.7,6.48 J6.4
N$24
  Top 0.254: J6.6 40.01,5.71 R30.1 R13.1
N$25
  Top 0.254: J6.8 43.31,4.95 R29.1 R18.1
N$26
  Top 0.254: J6.10 46.61,4.19 R28.1 R21.1
N$27
  Top 0.254: R27.1 R22.1 48.26,5.08 J6.12
N$28
  Top 0.254: R26.1 R23.1 51.56,4.32 J6.14
N$29
  Top 0.254: U6.4 59.69,46.1 60.2,46.61 61.05,46.61 | 61.05,46.61 R9.2 | 61.05,46.61 61.05,48.64 R10.1
N$30
  Top 0.254: R25.1 R24.1 54.86,5.33 54.61,5.08 J6.16
N$32
  Top 0.254: J4.3 60.33,17.14 60.33,23.11 58.42,25.02 58.42,31.75 60.83,34.16 SJ2.1
N$35
  Top 0.254: R40.1 R48.1 5.46,7.24 J7.2
N$36
  Top 0.254: J7.4 8.76,6.48 R47.1 R39.1
N$37
  Top 0.254: J7.6 12.06,5.71 R46.1 R38.1
N$38
  Top 0.254: J7.8 15.37,4.95 R45.1 R37.1
N$39
  Top 0.254: J7.10 18.8,4.06 R44.1 R36.1
N$40
  Top 0.254: R35.1 R43.1 22.1,4.32 J7.12
N$41
  Top 0.254: J7.14 23.75,4.19 R34.1 R42.1
N$42
  Top 0.254: J7.16 27.05,4.19 R33.1 R41.1
PLAYOUT  (via drill 0.25, 0.51)
  Top 0.254: U4.P$25 43.43,16.39 43.18,16.64 43.18,17.78 v43.56,18.16 | v56.39,17.14 47.75,17.14 45.21,19.68 v43.56,19.68
  Bottom 0.254: J8.2 60.33,24.77 60.33,19.05 58.42,17.14 v56.39,17.14 | v43.56,18.16 v43.56,19.68
RXD  (via drill 0.25, 0.51)
  Top 0.254: 49.09,22.86 U4.P$43 51.16,22.84 v51.18,22.86 | R14.1 57.02,15.88 57.57,16.42 R15.1 57.57,23.58 v57.4,23.75
  Bottom 0.254: v51.18,22.86 52.07,23.75 v57.4,23.75
SD_CD  (via drill 0.25, 0.51)
  Top 0.254: v17.78,27.94 17.78,28.07 17.4,28.45 16.13,28.45 J3.CD1 | v36.2,16.89 38.23,16.89 v38.35,17.02 | U4.P$26 43.93,17.01 v43.94,17.02
  Bottom 0.254: v17.78,27.94 17.78,17.65 20.57,14.86 29.21,14.86 31.37,16.89 v36.2,16.89 | v43.94,17.02 v38.35,17.02
SD_CK  (via drill 0.51)
  Top 0.254: J3.5 8.16,25.94 v8.89,26.67 | v10.16,33.02 36.83,33.02 38.1,31.75 43.56,31.75 44.96,30.35 44.96,27.55 U4.P$53
  Bottom 0.254: v8.89,26.67 8.89,31.75 v10.16,33.02
SD_CMD  (via drill 0.51)
  Top 0.254: J3.3 13.58,23.74 v13.97,24.13 R3.1 | U4.P$54 44.45,27.55 44.45,29.84 43.31,30.99 37.97,30.99 36.58,32.38 14.73,32.38 v13.97,31.62
  Bottom 0.254: v13.97,31.62 v13.97,24.13
SD_D0  (via drill 0.25, 0.51)
  Top 0.254: J3.7 12.5,28.14 13.97,26.67 R2.1 19.47,27.85 v19.56,27.94 | v31.5,26.8 32,26.8 32.64,27.43 34.16,27.43 35.05,26.54 38.35,26.54 39.75,25.15 39.75,22.99 40.89,21.84 46.1,21.84 v46.61,22.35 | v46.74,20.45 47.62,20.45 48.02,20.84 U4.P$39 49.05,20.83
  Bottom 0.254: v19.56,27.94 26.16,27.94 26.92,28.7 29.59,28.7 v31.5,26.8 | v46.74,20.45 46.74,22.23 v46.61,22.35
SD_D1  (via drill 0.25, 0.51)
  Top 0.254: J3.8 14,29.24 15.24,30.48 17.02,30.48 18.29,29.21 R1.1 19.47,30.01 19.94,30.48 25.02,30.48 v25.78,29.72 | U4.P$40 40.39,21.34 38.99,22.73 38.99,25.02 38.1,25.91 32.77,25.91 v32.51,26.16
  Bottom 0.254: v25.78,29.72 26.29,29.21 30.35,29.21 32.51,27.05 v32.51,26.16
SD_D2  (via drill 0.25, 0.51)
  Top 0.254: U4.P$51 45.93,26.12 45.72,25.91 v43.69,25.91 | 19.56,19.14 R5.1 12.83,19.05 v10.41,21.46 5.89,21.46 J3.1 | v18.16,30.99 18.41,31.24 35.69,31.24 37.21,29.72 41.66,29.72 42.16,29.21 v43.18,29.21
  Bottom 0.254: v18.16,30.99 17.91,30.99 15.24,33.66 12.45,33.66 10.54,31.75 10.54,21.59 v10.41,21.46 | v43.69,25.91 43.69,28.7 v43.18,29.21
SD_D3  (via drill 0.25, 0.51)
  Top 0.254: J3.2 11.78,22.64 v11.81,22.61 11.81,22.48 13.97,20.32 16.51,20.32 17.78,21.59 R4.1 19.56,21.68 | U4.P$52 45.43,31.28 v45.09,31.62 | v42.55,30.23 37.72,30.23 36.07,31.88 16.13,31.88 v15.75,31.5
  Bottom 0.254: v45.09,31.62 43.94,31.62 v42.55,30.23 | v15.75,31.5 15.75,31.62 14.48,32.89 12.7,32.89 11.81,32 v11.81,22.61
SPKR+  (via drill 0.51)
  Top 0.254: v55.88,43.18 55.88,49.78 56.52,50.42 U6.8
  Bottom 0.254: J5.2 57.15,41.91 v55.88,43.18
SPKR-
  Top 0.254: J5.1 60.96,40.64 60.96,42.55 62.23,43.81 62.23,50.04 61.98,50.29 61.17,50.29 R10.2 59.43,50.38 U6.5
TRIG00
  Top 0.254: U4.P$14 35.48,18.84 34.04,17.4 34.04,15.49 33.4,14.86 5.97,14.86 3.81,12.7 R40.2
TRIG01
  Top 0.254: U4.P$15 35.74,18.34 34.67,17.27 34.67,15.37 33.66,14.35 8.76,14.35 7.11,12.7 R39.2
TRIG02
  Top 0.254: U4.P$16 36,17.84 35.31,17.14 35.31,15.24 33.91,13.84 11.56,13.84 10.41,12.7 R38.2
TRIG03
  Top 0.254: R37.2 13.72,12.57 14.48,13.34 36.7,13.34 38.35,14.99 39.37,14.99 39.43,15.05 U4.P$17
TRIG04
  Top 0.254: U4.P$20 40.93,14.64 40.77,14.48 38.61,14.48 36.96,12.83 17.91,12.83 17.14,12.06 R36.2
TRIG05
  Top 0.254: U4.P$21 41.43,14.38 41.02,13.97 38.86,13.97 37.21,12.32 21.34,12.32 20.45,11.43 R35.2
TRIG06
  Top 0.254: U4.P$22 41.93,14.12 41.27,13.46 39.12,13.46 37.47,11.81 24.38,11.81 23.75,11.18 R34.2
TRIG07
  Top 0.254: U4.P$23 42.43,13.98 41.4,12.95 39.37,12.95 37.72,11.3 27.69,11.3 27.05,10.67 R33.2
TRIG08  (via drill 0.25)
  Top 0.254: U4.P$61 40.93,26.63 v41.91,25.65 | v30.48,9.02 30.48,9.27 30.99,9.78 31.71,9.78 R11.2
  Bottom 0.254: v41.91,25.65 41.91,24.13 42.8,23.24 42.8,18.8 41.78,17.78 37.85,17.78 37.59,17.53 37.59,14.73 36.32,13.46 34.42,13.46 31.75,10.79 31.75,10.29 v30.48,9.02
TRIG09  (via drill 0.25)
  Top 0.254: U4.P$62 40.43,26.12 v40.77,25.78 | 35.18,9.87 R12.2 35.05,10.41 34.67,10.79 30.86,10.79 v30.61,10.54
  Bottom 0.254: v40.77,25.78 40.77,24.51 42.29,22.99 42.29,18.92 41.66,18.29 37.34,18.29 37.08,18.03 37.08,15.24 35.94,14.1 34.16,14.1 v30.61,10.54
TRIG10  (via drill 0.25)
  Top 0.254: U4.P$29 45.43,14.89 46.1,14.22 47.5,14.22 48.26,13.46 v48.26,11.81 | R13.2 38.35,10.79 v38.48,10.92
  Bottom 0.254: v48.26,11.81 48.26,11.3 47.24,10.29 39.12,10.29 v38.48,10.92
TRIG11  (via drill 0.25)
  Top 0.254: U4.P$44 45.31,23.34 v44.83,22.86 | v41.66,11.43 R18.2
  Bottom 0.254: v44.83,22.86 44.83,14.61 v41.66,11.43
TRIG12  (via drill 0.25)
  Top 0.254: U4.P$45 45.88,23.84 v45.59,24.13 | v44.96,11.3 R21.2
  Bottom 0.254: v44.96,11.3 44.96,12.83 45.59,13.46 v45.59,24.13
TRIG13  (via drill 0.25)
  Top 0.254: U4.P$46 50.46,24.34 v50.67,24.13 | R22.2 48.26,10.67 49.15,11.56 49.15,12.32 50.04,13.21 v52.2,13.21
  Bottom 0.254: v50.67,24.13 50.67,23.75 50.16,23.24 50.16,16.76 50.8,16.13 50.8,14.61 v52.2,13.21
TRIG14  (via drill 0.25)
  Top 0.254: U4.P$49 46.93,28.64 47.24,28.96 v47.5,28.96 | v51.56,11.18 R23.2
  Bottom 0.254: v47.5,28.96 47.5,17.91 49.28,16.13 49.28,13.46 v51.56,11.18
TRIG15  (via drill 0.25, 0.51)
  Top 0.254: U4.P$50 46.43,29.67 47.12,30.35 48.01,30.35 v48.51,29.84 | v54.86,11.18 R24.2
  Bottom 0.254: v48.51,29.84 48.51,17.65 49.91,16.26 49.91,14.22 52.2,11.94 54.1,11.94 v54.86,11.18
TXD  (via drill 0.51)
  Top 0.254: U4.P$42 50.43,22.34 50.93,21.84 v52.32,21.84 | v58.42,19.18 58.42,13.97 J4.5
  Bottom 0.203: 56.26,21.84 58.42,19.68 v58.42,19.18
  Bottom 0.254: v52.32,21.84 56.26,21.84
VCC  (via drill 0.25, 0.51)
  Top 0.203: R29.2 43.98,9.74 44.13,9.65 v44.13,5.97 | v40.83,5.97 40.83,9.53 40.7,9.65 40.09,9.65 R30.2 | R31.2 37.44,9.74 37.53,9.65 v37.53,6.73 | R32.2 34.14,9.74 34.23,9.65 v34.23,6.73
  Top 0.254: C21.2 43.56,48.3 43.56,49.28 43.31,49.53 41.15,49.53 41.02,49.41 U5.1 41.02,47.12 40.51,46.61 | 36.45,47.12 36.45,48.59 U5.8 36.48,51.16 35.56,52.07 C27.2 34.89,53.76 33.66,54.99 SJ4.1 SJ4.2 29.34,54.99 28.96,54.61 28.96,53.98 28.32,53.34 C5.1 v27.56,51.82 | 36.45,47.12 35.47,46.14 C26.2 C22.1 | U5.20 41.02,46.1 40.51,46.61 | 23.75,38.48 24.13,38.1 28.03,38.1 28.79,38.86 | 23.75,38.48 23.75,39.33 C11.1 | 20.83,35.56 R17.1 18.67,35.52 18.67,34.67 18.41,34.42 10.29,34.42 8.76,32.89 3.05,32.89 1.4,31.24 1.4,26.04 2.67,24.77 4.06,24.77 | 20.83,35.56 23.75,38.48 | R5.2 R4.2 R3.2 R2.2 R1.2 v22.86,29.21 | v5.46,18.67 3.81,20.32 3.81,24.51 4.06,24.77 | J3.4 5.54,24.77 4.06,24.77 | 20.83,35.56 21.59,35.56 v22.1,35.05 | 28.79,38.86 C19.1 28.79,43.81 28.57,44.03 C12.1 27.94,45.21 27.62,45.53 U2.5 28.55,46.96 28.96,47.37 28.96,49.28 v28.83,49.4 | 28.79,38.86 v28.79,34.96 | v29.97,30.1 30.23,30.1 32.38,27.94 C18.1 35.18,27.9 35.18,27.3 35.43,27.05 38.48,27.05 38.96,27.53 U4.P$64 39.43,26.1 40.77,24.77 40.77,24.64 | 40.77,24.64 40.77,23.24 v41.27,22.73 | 40.77,24.64 41.02,24.89 43.94,24.89 44.39,25.34 U4.P$48 49.85,25.34 50.29,25.78 | v39.24,19.05 38.23,19.05 37.94,19.34 U4.P$13 34.58,19.34 34.04,18.8 33.27,18.8 33.02,18.54 C13.1 | v49.53,27.94 49.53,26.54 50.29,25.78 | 50.29,25.78 51.02,25.78 C10.1 | R29.2 C9.1 43.98,11.47 44.7,12.19 v45.85,12.19 45.85,10.92 46.61,10.16 R28.2 | R26.2 53.21,10.41 52.83,10.79 52.83,12.7 | 52.83,12.7 53.21,13.08 53.59,13.08 53.72,13.21 53.72,13.93 R19.1 53.76,14.99 | 53.76,14.99 R14.2 53.21,15.88 52.45,16.64 49.28,16.64 49.15,16.51 49.15,15.79 C15.1 49.12,15.68 48.26,15.68 v48.01,15.43 47.75,15.68 U4.P$32 46.93,17.2 45.21,18.92 42.04,18.92 41.91,19.05 v41.4,19.05 41.4,17.78 40.43,16.81 U4.P$19
  Top 0.254: R48.2 v5.46,11.18 | v8.76,11.18 R47.2 | R46.2 v12.06,11.18 | R45.2 v15.37,11.18 | R44.2 v18.8,11.18 | R43.2 v22.1,11.18 | R42.2 v25.4,10.92 | v29.72,7.11 29.72,9.4 29.34,9.78 28.74,9.78 R41.2 | R25.2 56.52,14.61 56.26,14.86 53.89,14.86 53.76,14.99 | R27.2 49.91,11.3 50.67,12.06 52.2,12.06 52.83,12.7 | 36.45,47.12 36.45,46.86 36.83,46.48 40.39,46.48 40.51,46.61
  Bottom 0.203: v44.13,5.97 v40.83,5.97 38.29,5.97 v37.53,6.73 v34.23,6.73
  Bottom 0.254: v49.53,27.94 57.15,27.94 58.42,29.21 J8.3 | v22.86,29.21 22.86,34.29 v22.1,35.05 | 29.84,30.23 v29.97,30.1 29.97,33.27 28.79,34.46 v28.79,34.96 | v39.24,19.05 v41.4,19.05 41.66,19.3 41.66,20.19 41.27,20.57 v41.27,22.73 | v45.85,12.19 47.24,12.19 48.01,12.95 v48.01,15.43 48.26,15.68 | v29.72,7.11 29.46,6.86 26.8,6.86 26.29,7.37 26.29,10.54 25.91,10.92 v25.4,10.92 25.15,11.18 v22.1,11.18 v18.8,11.18 v15.37,11.18 v12.06,11.18 v8.76,11.18 v5.46,11.18 v5.46,18.67 | v28.83,49.4 28.83,50.55 v27.56,51.82
VIN_9V
  Top 0.254: J1.VIN0 5.7,51.42 8.89,54.61 C1.1 | U1.3 22.15,50.24 21.59,50.8 16.51,50.8 14.91,52.4 C1.1 | 15.24,54.48 C1.1

### Text on the board
Bottom: v30
tPlace: AMPIN | GND | 3.3V | 5V | + | - | MP3 Trigger Pro | 5V | GND | BT0 | 3.3V | robertsonics | 5V | 3.3V | PLO | GND | GND | 5V | LED | RX | TX | T0 | T1 | T2 | T3 | T4 | T5 | T6 | T7 | T8 | T9 | T10 | T11 | T12 | T13 | T14 | T15 | GND | GND | Triggers | Triggers
tNames: Jamie Robertson, Jordan McConnell